# EAGLE design SController-8833 (EAGLE 9.3.0)
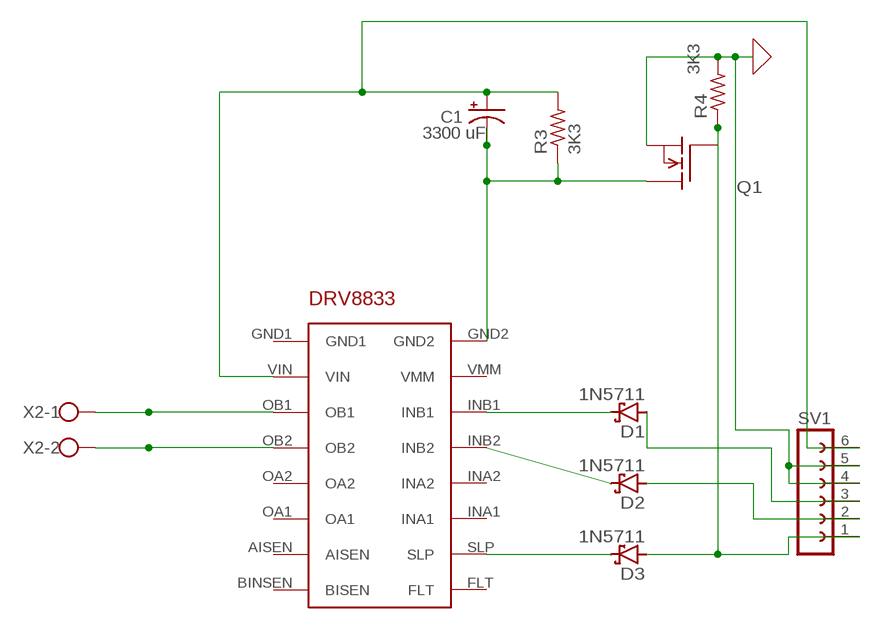
[diagram p0: schematic, sheet 1]

## Parts
""  POLOLU-DRV8833  [POLOLU-DRV8833]
C1  3300 uF  CPOL-USE5-10.5  [E5-10,5]
D1  1N5711  SCHOTTKY-DIODEF126Z12  [F126Z12]
D2  1N5711  SCHOTTKY-DIODEF126Z12  [F126Z12]
D3  1N5711  SCHOTTKY-DIODEF126Z12  [F126Z12]
Q1  SUP75N06-08  [TO220]
R3  3K3  R-US_0204/7  [0204/7]
R4  R-US_0204/7  [0204/7]
SV1  FE06-1  [FE06]
X2  W237-102  [W237-102]

## Nets
0: Q1.3(S) R4.2 SV1.4 SV1.5 ; supply symbol labelled GND
N$1: "".INB1 D1.C
N$2: "".INB2 D2.C
N$3: "".SLP D3.C
N$4: "".VIN C1.+ R3.2 SV1.6
N$5: "".GND2 C1.- Q1.2(D) R3.1
N$6: "".OB1 X2.1
N$7: D3.A Q1.1(G) R4.1 SV1.1
N$9: D2.A SV1.2
N$10: "".OB2 X2.2
N$11: D1.A SV1.3
Unconnected: "".AISEN "".BINSEN(BISEN) "".FLT "".GND1 "".INA1 "".INA2 "".OA1 "".OA2 "".VMM

## Library data of the parts
"" = Pololu_Driver_DRV8833:POLOLU-DRV8833: Created by: Deltarios DRV8833 pololu dual drive controller, PCB-ready device
C1 = rcl:CPOL-US: POLARIZED CAPACITOR, American symbol; SPICEPREFIX: C
D1-D3 = diode:SCHOTTKY-DIODE: Schottky Diode
Q1 = transistor-fet:SUP75N06-08: N-Channel Enhancement MOSFET 60V; 75A; 0,008Ohm
R3 = rcl:R-US_: RESISTOR, American symbol; SPICEPREFIX: R
R4 = rcl:R-US_: RESISTOR, American symbol; SPICEPREFIX: 3K3
SV1 = con-lsta:FE06-1: FEMALE HEADER; OC_FARNELL: unknown; OC_NEWARK: unknown
X2 = con-wago-500:W237-102: WAGO SCREW CLAMP; MPN: 237-102; OC_FARNELL: unknown; OC_NEWARK: 70K9898

## Net classes
0 default: width 1.016 mm, drill 1.016 mm, clearance 0.508 mm

## Board
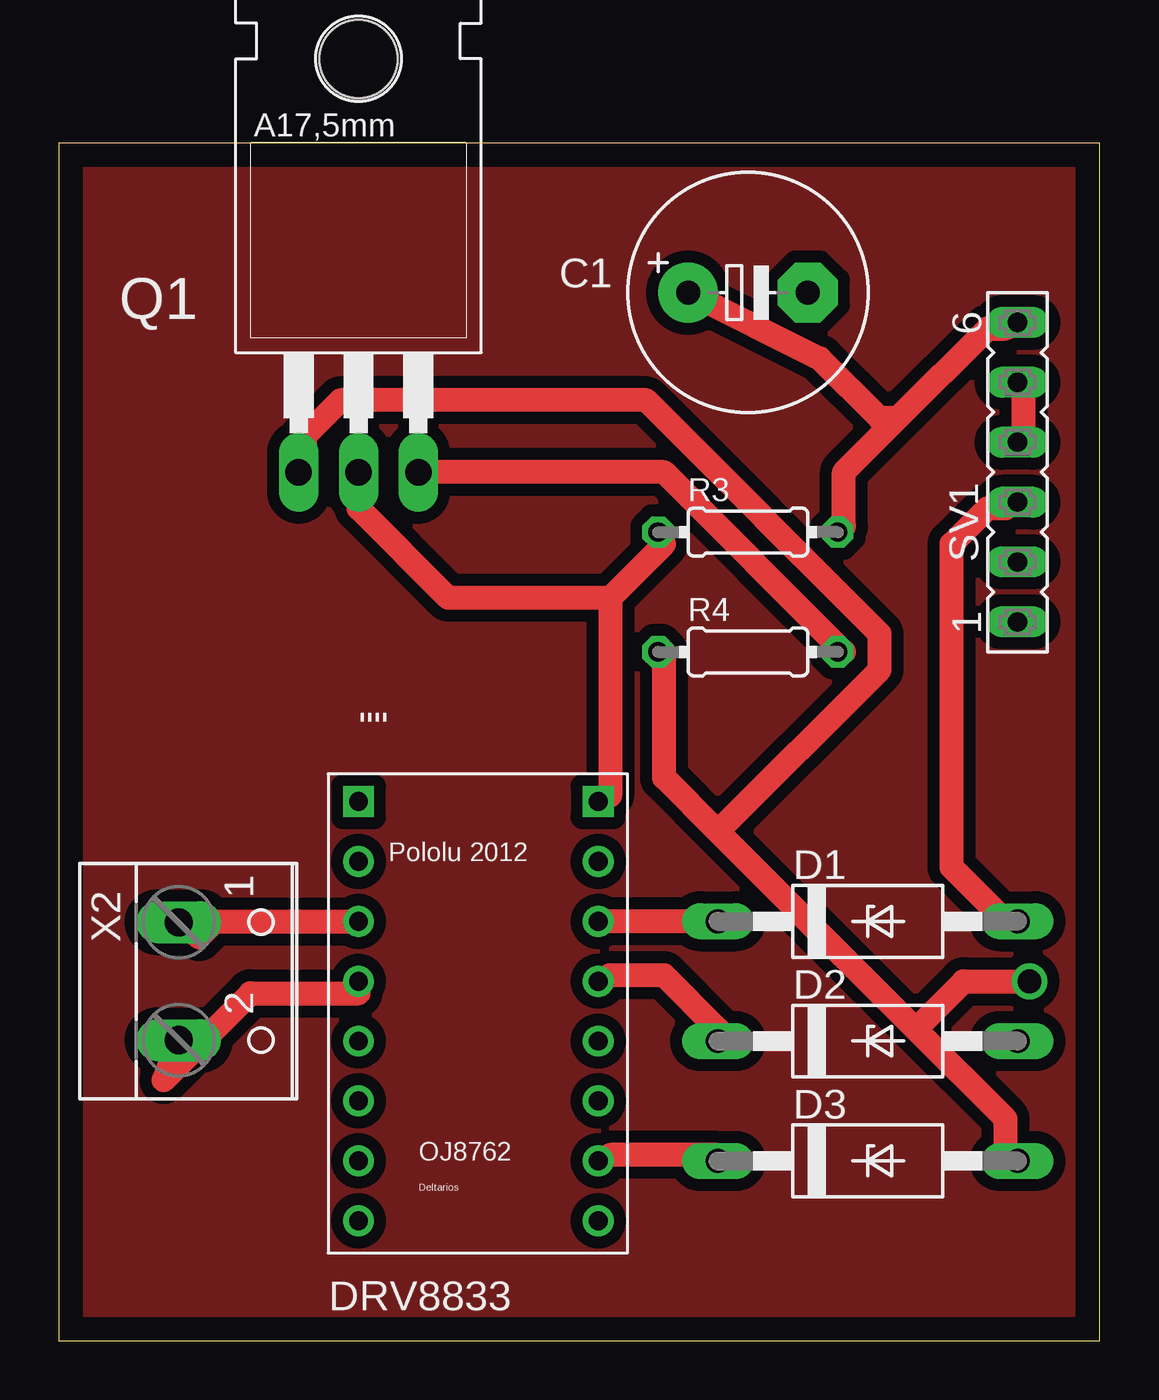
[diagram p1: board, top side]
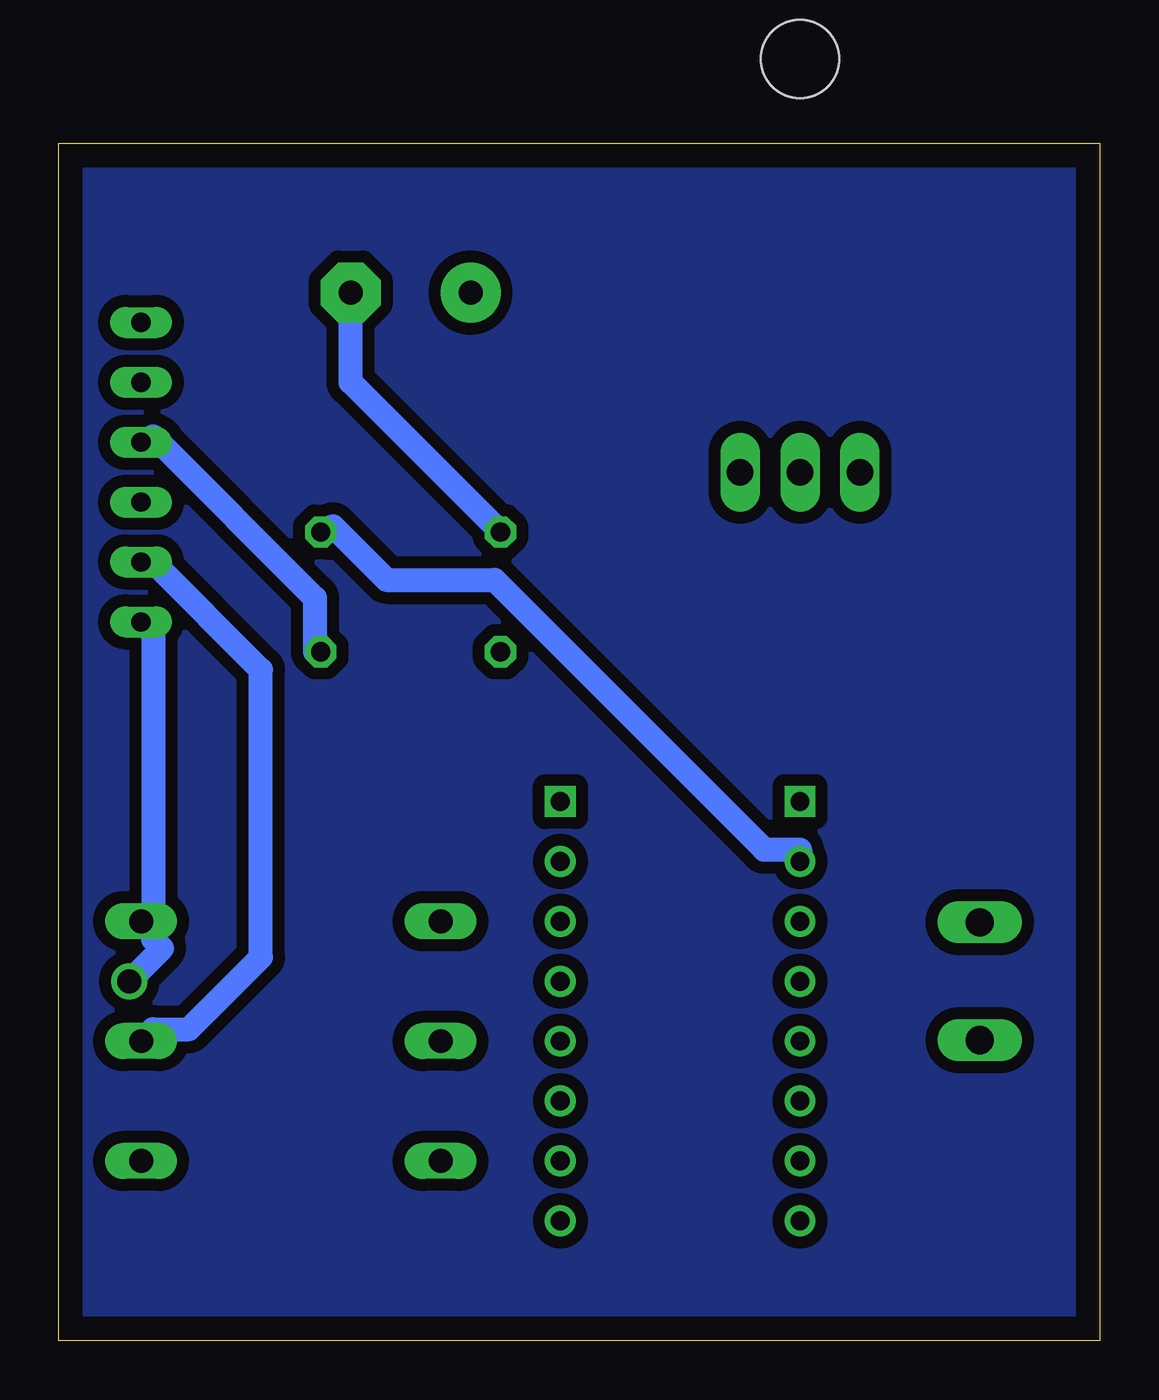
[diagram p2: board, bottom side, seen from below]

Size 44.12 x 50.79 mm. Coordinates in mm from the lower left corner, seen from the top.
Outline: 0,0 44.12,0 44.12,50.79 0,50.79 0,0
Copper layers (1*16): Top 0.035mm / dielectric 1.5mm / Bottom 0.035mm
Design rules "default": minimum track width 6mil, minimum drill 0.35mm, track to track 6mil, track to pad 6mil, pad to pad 6mil, via to via 6mil, smd to smd 6mil, copper to edge 40mil, drill to drill 6mil, minimum pad ring 10mil, minimum via ring 8mil, stop-mask expansion 4mil, vias tented up to drill 0mil, thermal gap 10mil

### Footprints (pad centres in the part's own frame; a part is rotated, then mirrored left to right if it is on the bottom)
POLOLU-DRV8833 = drill 0.8: AISEN -3.81,-7.62; BINSEN -3.81,-10.16; FLT 6.35,-10.16; INA1 6.35,-5.08; INA2 6.35,-2.54; INB1 6.35,2.54; INB2 6.35,0; OA1 -3.81,-5.08; OA2 -3.81,-2.54; OB1 -3.81,2.54; OB2 -3.81,0; SLP 6.35,-7.62; VIN -3.81,5.08; VMM 6.35,5.08 | drill 0.8 square: GND1 -3.81,7.62; GND2 6.35,7.62
E5-10,5 = drill 1.016 pad 2.54: + -2.54,0 | drill 1.016 pad 2.54 octagon: - 2.54,0
F126Z12 = drill 1.016 long: A 6.35,0; C -6.35,0
TO220 = drill 1.118 long: 1 -2.54,-6.35; 2 0,-6.35; 3 2.54,-6.35 | hole 3.302: 0,11.176
0204/7 = drill 0.813 octagon: 1 -3.81,0; 2 3.81,0
FE06 = drill 0.813 long: 1 -6.35,0; 2 -3.81,0; 3 -1.27,0; 4 1.27,0; 5 3.81,0; 6 6.35,0
W237-102 = drill 1.194 long: 1 -2.5,-1.27; 2 2.5,-1.27

### Placement (x,y rotation side)
""  16.51,15.24 0 top
C1  29.21,44.45 0 top
D1  34.29,17.78 0 top
D2  34.29,12.7 0 top
D3  34.29,7.62 0 top
Q1  12.7,43.18 0 top
R3  29.21,34.29 0 top
R4  29.21,29.21 0 top
SV1  40.64,36.83 90 top
X2  6.35,15.24 270 top

### Tracks (layer width: path | path; a pad name or v marks a point on that pad's centre or on a via)
0
  Top 1.016: SV1.5 40.89,40.64 40.89,38.35 SV1.4 | Q1.3 25.65,36.83 33.27,29.21 R4.2
  Bottom 1.016: R4.2 33.27,29.21 33.27,31.5 40.13,38.35 SV1.4
GNDP1
  pour Bottom (isolate 0.406): 0,50.8 0,0 44.45,0 44.45,50.8
GNDP2
  pour Top (isolate 0.406): 0,50.8 0,0 44.45,0 44.45,50.8
N$1
  Top 1.016: D1.C "".INB1
N$2
  Top 1.016: "".INB2 23.37,15.49 25.65,15.49 27.94,13.21 D2.C
N$3
  Top 1.016: "".SLP 23.37,7.87 27.94,7.87 D3.C
N$4
  Top 1.016: 35.56,39.12 33.27,36.83 33.27,34.54 R3.2 | 35.56,39.12 39.37,42.93 40.13,42.93 SV1.6 | 35.56,39.12 34.8,39.12 32.26,41.66 C1.+
  Bottom 1.016: "".VIN 12.7,20.83 14.22,20.83 25.65,32.26 30.23,32.26 32.51,34.54 R3.2
N$5
  Top 1.016: 23.37,31.5 23.37,23.11 "".GND2 | 23.37,31.5 25.65,33.78 R3.1 | Q1.2 12.7,35.31 16.51,31.5 23.37,31.5
  Bottom 1.016: C1.- 31.75,40.64 R3.1
N$6
  Top 1.016: "".OB1 6.6,17.78 5.94,17.12 X2.1
N$7  (via drill 1.02)
  Top 1.016: 36.32,13.21 40.13,9.4 40.13,7.87 D3.A | 36.32,13.21 27.94,21.59 | 27.94,21.59 25.65,23.88 25.65,29.21 R4.1 | v41.15,15.24 38.35,15.24 36.32,13.21 | 27.94,21.59 34.8,28.45 34.8,29.97 24.89,39.88 11.94,39.88 10.41,38.35 10.41,36.83 Q1.1
  Bottom 1.016: v41.15,15.24 39.75,16.64 40.13,17.02 40.13,29.97 SV1.1
N$9
  Bottom 1.016: SV1.2 40.13,33.02 35.56,28.45 35.56,16.26 38.61,13.21 40.13,13.21 D2.A
N$10
  Top 1.016: "".OB2 12.7,14.73 8.13,14.73 4.44,11.04 X2.2
N$11
  Top 1.016: SV1.3 40.13,35.31 39.37,35.31 37.85,33.78 37.85,20.07 40.13,17.78 D1.A